# Altium schematic sheet Transcievers.SchDoc
size A; Organization: Machine Intelligence Laboratory; Address1: 1889 Museum Rd; Address2: Room 3001; Address3: Gainesville, FL, 32611; SheetNumber: 4; SheetTotal: 4
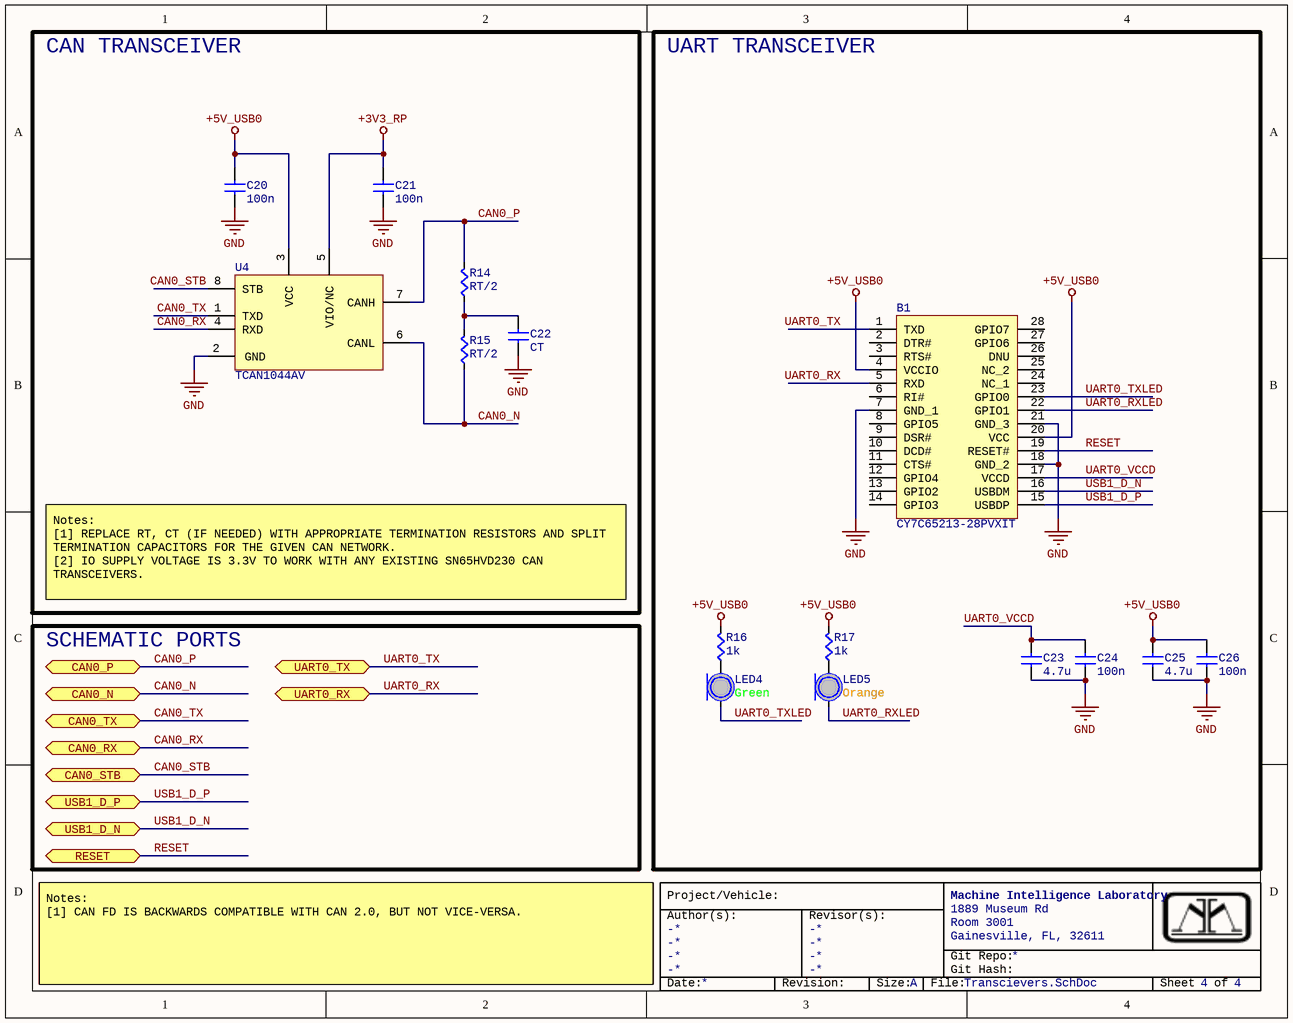
[diagram p0: Transcievers.SchDoc]

## Parts
B1  CY7C65213-28PVXIT  [SOP65P780X200-28N]
C20  value 100n  [CAPC0805]  (hidden comment: Cap)
C21  value 100n  [CAPC0805]  (hidden comment: Cap)
C22  value CT  [CAPC0805]  (hidden comment: Cap)
C23  value 4.7u  [CAPC0805]  (hidden comment: Cap)
C24  value 100n  [CAPC0805]  (hidden comment: Cap)
C25  value 4.7u  [CAPC0805]  (hidden comment: Cap)
C26  value 100n  [CAPC0805]  (hidden comment: Cap)
LED4  Color: Green  [LED0603]  (hidden comment: LED)
LED5  Color: Orange  [LED0603]  (hidden comment: LED)
R14  value RT/2  [RES0603]  (hidden comment: Res)
R15  value RT/2  [RES0603]  (hidden comment: Res)
R16  value 1k  [RES0603]  (hidden comment: Res)
R17  value 1k  [RES0603]  (hidden comment: Res)
U4  TCAN1044AV  [SOT65P280X110-8N]

## Blocks framed on the sheet
CAN TRANSCEIVER: C20-C22 R14 R15 U4
UART TRANSCEIVER: B1 C23-C26 LED4 LED5 R16 R17

## Ports
CAN0_N (bidir, see Connectors[5D]), CAN0_P (bidir, see Connectors[5E]), CAN0_RX (bidir, see Microcontroller[2C]), CAN0_STB (bidir, see Microcontroller[2C]), CAN0_TX (bidir, see Microcontroller[2C]), RESET (bidir, see Microcontroller[2D]), UART0_RX (bidir, see Microcontroller[3C]), UART0_TX (bidir, see Microcontroller[3C]), USB1_D_N (bidir, see Connectors[5E]), USB1_D_P (bidir, see Connectors[5E])

## Nets
+3V3_RP: C21.1(A) U4.5(VIO/NC)
+5V_USB0: B1.4(VCCIO) B1.20(VCC) C20.1(A) C25.1(A) C26.1(A) R16.1(A) R17.1(A) U4.3(VCC)
GND: B1.7(GND_1) B1.18(GND_2) B1.21(GND_3) C20.2(B) C21.2(B) C22.2(B) C23.2(B) C24.2(B) C25.2(B) C26.2(B) U4.2(GND)
CAN0_N: R15.2(B) U4.6(CANL) ; port CAN0_N
CAN0_P: R14.1(A) U4.7(CANH) ; port CAN0_P
CAN0_RX: U4.4(RXD) ; port CAN0_RX
CAN0_STB: U4.8(STB) ; port CAN0_STB
CAN0_TX: U4.1(TXD) ; port CAN0_TX
RESET: B1.19(RESET#) ; port RESET
UART0_RX: B1.5(RXD) ; port UART0_RX
UART0_RXLED: B1.22(GPIO1) LED5.C
UART0_TX: B1.1(TXD) ; port UART0_TX
UART0_TXLED: B1.23(GPIO0) LED4.C
UART0_VCCD: B1.17(VCCD) C23.1(A) C24.1(A)
USB1_D_N: B1.16(USBDM) ; port USB1_D_N
USB1_D_P: B1.15(USBDP) ; port USB1_D_P
NetC22_1: C22.1(A) R14.2(B) R15.1(A)
NetLED4_A: LED4.A R16.2(B)
NetLED5_A: LED5.A R17.2(B)

Not connected (* = marked no-connect by the designer): B1 2(DTR#) 3(RTS#) 6(RI#) 8(GPIO5) 9(DSR#) 10(DCD#) 11(CTS#) 12(GPIO4) 13(GPIO2) 14(GPIO3) 24(NC_1) 25(NC_2) 26(DNU) 27(GPIO6) 28(GPIO7)

## Notes on the sheet
- Notes:
  [1] REPLACE RT, CT (IF NEEDED) WITH APPROPRIATE TERMINATION RESISTORS AND SPLIT TERMINATION CAPACITORS FOR THE GIVEN CAN NETWORK.
  [2] IO SUPPLY VOLTAGE IS 3.3V TO WORK WITH ANY EXISTING SN65HVD230 CAN TRANSCEIVERS.
- SCHEMATIC PORTS
- Notes:
  [1] CAN FD IS BACKWARDS COMPATIBLE WITH CAN 2.0, BUT NOT VICE-VERSA.
- Project/Vehicle:
- PLACE NOTES BOX HERE
- Author(s):
- -
- Revisor(s):
- Git Repo:
- Git Hash:
- Date:
- Revision:
- Size:
- A
- File:
- Sheet
- of

## Library data of the parts
B1 = CY7C65213-28PVXIT: USB Interface IC 32KB USB-UART LP Bridge Controller; Manufacturer_Name: Infineon; Geometry.Height: 2mm; Manufacturer_Part_Number: CY7C65213-28PVXIT; Mouser Part Number: 727-CY7C6521328PVXIT; Mouser Price/Stock: https://www.mouser.co.uk/ProductDetail/Infineon-Technologies/CY7C65213-28PVXIT?qs=cwEsOGdHuFTfRgwUJVDa5g%3D%3D; Arrow Part Number: CY7C65213-28PVXIT; Arrow Price/Stock: https://www.arrow.com/en/products/cy7c65213-28pvxit/infineon-technologies-ag?region=nac; Datasheet Link: https://componentsearchengine.com/Datasheets/2/CY7C65213-28PVXIT.pdf
U4 = TCAN1044AVDDFRQ1: 1/1 Transceiver Half CANbus TSOT-23-8; Supplier 1: Digikey; Supplier Part Number 1: 296-TCAN1057ADDFRQ1CT-ND
C20-C26 = Cap: Supplier 1: Digi-Key; Supplier Part Number 1: 1276-1000-1-ND
LED4 LED5 = LED: Supplier 1: Digi-Key; Supplier Part Number 1: 754-1122-1-ND
R14-R17 = Res: Supplier 1: Digi-Key; Supplier Part Number 1: RMCF0603JT10K0CT-ND